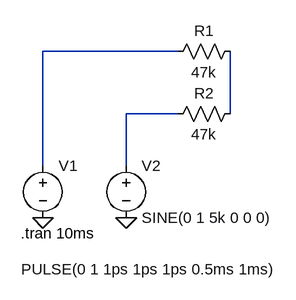
[diagram p0: schematic Draft2.asc]
Draft2.asc, the LTspice schematic file:
Version 4
SHEET 1 880 680
WIRE 320 48 112 48
WIRE 320 144 240 144
WIRE 400 144 400 48
WIRE 112 224 112 48
WIRE 240 224 240 144
FLAG 112 304 0
FLAG 240 304 0
SYMBOL voltage 112 208 R0
WINDOW 3 -33 175 Left 2
WINDOW 123 0 0 Left 2
WINDOW 39 0 0 Left 2
SYMATTR InstName V1
SYMATTR Value PULSE(0 1 1ps 1ps 1ps 0.5ms 1ms)
SYMBOL voltage 240 208 R0
WINDOW 123 0 0 Left 2
WINDOW 39 0 0 Left 2
SYMATTR InstName V2
SYMATTR Value SINE(0 1 5k 0 0 0)
SYMBOL res 416 32 R90
WINDOW 0 0 56 VBottom 2
WINDOW 3 32 56 VTop 2
SYMATTR InstName R1
SYMATTR Value 47k
SYMBOL res 416 128 R90
WINDOW 0 0 56 VBottom 2
WINDOW 3 32 56 VTop 2
SYMATTR InstName R2
SYMATTR Value 47k
TEXT 78 328 Left 2 !.tran 10ms

The netlist it stands for:
* Draft2.asc
V1 N001 0 PULSE(0 1 1ps 1ps 1ps 0.5ms 1ms)
V2 N002 0 SINE(0 1 5k 0 0 0)
R1 N003 N001 47k
R2 N003 N002 47k
.tran 10ms
.backanno
.end